# Altium schematic sheet 2_POWER.SchDoc
size A; SheetNumber: 2; SheetTotal: 3
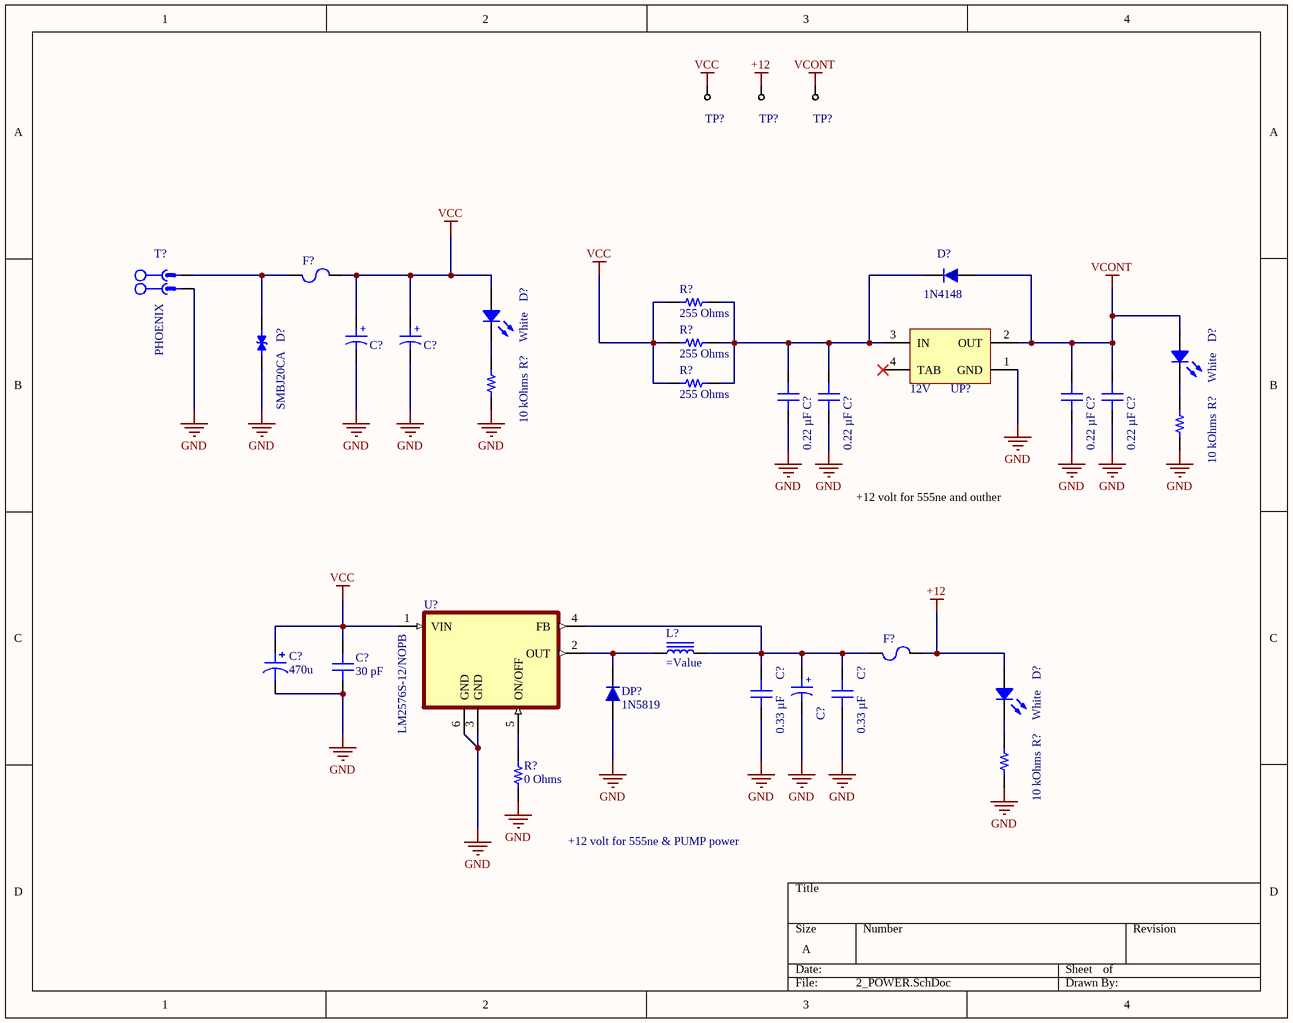
[diagram p0: 2_POWER.SchDoc]

## Parts
(Parts that share a designator on the sheet are numbered #1, #2 ... from top to bottom, then left to right.)
C?#1  Cap 10x21  [Cap electrolitic radial 10x20-5]  (value not drawn)
C?#2  Cap 10x21  [Cap electrolitic radial 10x20-5]  (value not drawn)
C?#3  0.22 µF  [CAP 1206_3216 - 0.8MM]
C?#4  0.22 µF  [CAP 1206_3216 - 0.8MM]
C?#5  0.22 µF  [CAP 1206_3216 - 0.8MM]
C?#6  0.22 µF  [CAP 1206_3216 - 0.8MM]
C?#7  470u  [CAP TH ALUM ELEC D10.00mm S5.00mm H17.50mm]
C?#8  30 pF  [CAP 0603_1608]
C?#9  Cap 10x21  [Cap electrolitic radial 10x20-5]  (value not drawn)
C?#10  0.33 µF  [CAP 0603_1608]
C?#11  0.33 µF  [CAP 0603_1608]
D?#1  1N4148  [Diode 1n4148 SMD]
D?#2  White  [LED 0603_1608]
D?#3  SMBJ20CA  [SMBJ20CA]
D?#4  White  [LED 0603_1608]
D?#5  White  [LED 0603_1608]
DP?  1N5819  [1N5819]
F?#1  3413.0214.22  [FUSE 1206_3216 0.6MM]  (value not drawn)
F?#2  3413.0214.22  [FUSE 1206_3216 0.6MM]  (value not drawn)
L?  (no value)  [BOURNS SRR1280]
R?#1  255 Ohms  [RES 1206_3216]
R?#2  255 Ohms  [RES 1206_3216]
R?#3  10 kOhms  [RES 0603_1608]
R?#4  255 Ohms  [RES 1206_3216]
R?#5  10 kOhms  [RES 0603_1608]
R?#6  10 kOhms  [RES 0603_1608]
R?#7  0 Ohms  [RES 0603_1608]
T?  PHOENIX  [ptr]
TP?#1  Test Point  [Test Point]  (value not drawn)
TP?#2  Test Point  [Test Point]  (value not drawn)
TP?#3  Test Point  [Test Point]  (value not drawn)
U?  LM2576S-12/NOPB  [LM2576S-12/NOPB]
UP?  12V  [SOT223]

## Nets
+12: D?#5.1 F?#2.2 TP?#2.1(T)
GND: C?#1.2 C?#2.2 C?#3.1 C?#4.1 C?#5.1 C?#6.1 C?#7.2 C?#8.1 C?#9.2 C?#10.1 C?#11.1 D?#3.1 DP?.1 R?#3.1 R?#5.1 R?#6.1 R?#7.1 T?.1 U?.3(GND) U?.6(GND) UP?.1(GND)
VCC: C?#1.1 C?#2.1 C?#7.1 C?#8.2 D?#2.1 F?#1.2 R?#1.1 R?#2.1 R?#4.1 TP?#1.1(T) U?.1(VIN)
VCONT: C?#5.2 C?#6.2 D?#1.1 D?#4.1 TP?#3.1(T) UP?.2(OUT)
NetC?#3_2: C?#3.2 C?#4.2 D?#1.2 R?#1.2 R?#2.2 R?#4.2 UP?.3(IN)
NetC?#9_1: C?#9.1 C?#10.2 C?#11.2 F?#2.1 L?.2 U?.4(FB)
NetD?#2_2: D?#2.2 R?#3.2
NetD?#3_2: D?#3.2 F?#1.1 T?.2
NetD?#4_2: D?#4.2 R?#5.2
NetD?#5_2: D?#5.2 R?#6.2
NetDP?_2: DP?.2 L?.1 U?.2(OUT)
NetR?#7_2: R?#7.2 U?.5(ON/OFF)

Not connected (* = marked no-connect by the designer): UP? 4(TAB)*

## Notes on the sheet
- +12 volt for 555ne and outher controler
- +12 volt for 555ne & PUMP power
- (in symbol Cap electrolitic radial 10x21) +

## Library data of the parts
C?#1 C?#2 C?#9 = Cap electrolitic radial 10x21: Cap electrolitic radial; Part. No: 100U/50V; Designer: Abbas Basereh; Data: 16-12-2016
C?#3-C?#6 = 885012208089: CAP CER 0.22UF 50V X7R 1206; manufacturer: Würth Elektronik; Tolerance: ±10%; Part Number: 885012208089; Value: 0.22 µF; Applications: General Purpose; Capacitance: 0.22 µF; componentlink1description: Datasheet; componentlink1url: https://katalog.we-online.de/pbs/datasheet/885012208089.pdf; componentlink2description: DigiKey Link; componentlink2url: https://www.digikey.com/en/products/detail/würth-elektronik/885012208089/5453557; Device Package: 1206 (3216 Metric); lastupdated: 1/30/2023 8:13:35 PM; Lifecycle Status: Active; Minimum Order: 1; Mounting Type: Surface Mount, MLCC; Operating Temperature: -55°C ~ 125°C; Package / Case: 1206 (3216 Metric); packaging: TapeAndReel; partid: 19236; Part Status: Active; price: 0.10; series: WCAP-CSGP; Size / Dimension: 0.126" L x 0.063" W (3.20mm x 1.60mm); Supplier 1: DigiKey; Supplier Part Number 1: 732-7702-1-ND; Temperature Coefficient: X7R; Thickness (Max): 0.041" (1.05mm); Voltage - Rated: 50V
C?#7 = UBX1C221MPL1TD: CAP ALUM 220UF 20% 16V RADIAL; manufacturer: Nichicon; Capacitance: 220µF; Lifetime @ Temp.: 1000 Hrs @ 150°C; Polarization: Polar; Ripple Current @ High Frequency: 300mA @ 100kHz; Ripple Current @ Low Frequency: 150mA @ 120Hz; value: 220µF; Part Number: UBX1C221MPL1TD; Applications: Automotive; componentlink1description: Datasheet; componentlink1url: http://nichicon-us.com/english/products/pdfs/e-ubx.pdf; componentlink2description: DigiKey Link; componentlink2url: http://digikey.com/product-detail/en/nichicon/UBX1C221MPL1TD/493-13194-1-ND/4333204; Device Package: Radial, Can; Height - Seated (Max): 0.689" (17.50mm); lastupdated: 9/2/2020 1:31:25 AM; Lead Spacing: 0.197" (5.00mm); Lifecycle Status: Active; Minimum Order: 1; Mounting Type: Through Hole; Operating Temperature: -55°C ~ 150°C; Package / Case: Radial, Can; packaging: TapeAndBox; partid: 12068; Part Status: Active; price: 0.49; series: UBX; Size / Dimension: 0.394" Dia (10.00mm); Supplier 1: DigiKey; Supplier Part Number 1: 493-13194-1-ND; Tolerance: ±20%; Voltage - Rated: 16V
C?#8 = 600S300FT250XT: CAP CER 30PF 250V C0G/NP0 0603; manufacturer: American Technical Ceramics; Temperature Coefficient: C0G, NP0; Tolerance: ±1%; Part Number: 600S300FT250XT; Value: 30 pF; Applications: RF, Microwave, High Frequency, Bypass, Decoupling; Capacitance: 30 pF; componentlink1description: Datasheet; componentlink1url: http://www.atceramics.com/UserFiles/600s.pdf; componentlink2description: DigiKey Link; componentlink2url: https://www.digikey.com/en/products/detail/american-technical-ceramics/600S300FT250XT/3905218; Device Package: 0603 (1608 Metric); Features: High Q, Low Loss, Ultra Low ESR; lastupdated: 1/30/2023 8:08:28 PM; Lifecycle Status: Active; Minimum Order: 1; Mounting Type: Surface Mount, MLCC; Operating Temperature: -55°C ~ 125°C; Package / Case: 0603 (1608 Metric); packaging: TapeAndReel; partid: 2159; Part Status: Active; price: 0.49; series: ATC 600S; Size / Dimension: 0.063" L x 0.032" W (1.60mm x 0.81mm); Supplier 1: DigiKey; Supplier Part Number 1: 1284-1205-1-ND; Thickness (Max): 0.035" (0.89mm); Voltage - Rated: 250V
C?#10 C?#11 = CC0603KRX7R6BB334: CAP CER 0.33UF 10V X7R 0603; manufacturer: Yageo; Tolerance: ±10%; Part Number: CC0603KRX7R6BB334; Value: 0.33 µF; Applications: General Purpose; Capacitance: 0.33 µF; componentlink1description: Datasheet; componentlink1url: https://www.yageo.com/upload/media/product/productsearch/datasheet/mlcc/UPY-GPHC_X7R_6.3V-to-50V_18.pdf; componentlink2description: DigiKey Link; componentlink2url: https://www.digikey.com/en/products/detail/yageo/CC0603KRX7R6BB334/5883747; Device Package: 0603 (1608 Metric); lastupdated: 1/30/2023 8:08:28 PM; Lifecycle Status: Active; Minimum Order: 1; Mounting Type: Surface Mount, MLCC; Operating Temperature: -55°C ~ 125°C; Package / Case: 0603 (1608 Metric); packaging: TapeAndReel; partid: 2209; Part Status: Active; price: 0.01; series: CC; Size / Dimension: 0.063" L x 0.031" W (1.60mm x 0.80mm); Supplier 1: DigiKey; Supplier Part Number 1: 311-3368-1-ND; Temperature Coefficient: X7R; Thickness (Max): 0.035" (0.90mm); Voltage - Rated: 10V
D?#1 = 1N4148 SMD: General Semicoductor
D?#2 D?#4 D?#5 = CL-194S-WS-SD-T: LED WHITE SMD; Manufacturer: Citizen; Configuration: Standard; Current - Test: 5mA; Lens Color: 0.30mm; Lens Size: 1.10mm x 0.80mm; Lens Style: Rectangle with Flat Top; Millicandela Rating: 260mcd; Voltage - Forward (Vf) (Typ): 2.9V; Part Number: CL-194S-WS-SD-T; Color: White; ComponentLink1Description: Datasheet; ComponentLink1URL: http://ce.citizen.co.jp/up_img/product/WBtpQ6f1JXom/CL-194S.pdf; ComponentLink2Description: DigiKey Link; ComponentLink2URL: https://www.digikey.com/en/products/detail/citizen/CL-194S-WS-SD-T/6005902; Device Package: 0603 (1608 Metric); Height (Max): 0.30mm; LastUpdated: 1/30/2023 8:53:40 PM; Lifecycle Status: Active; Minimum Order: 1; Mounting Type: Surface Mount; Package / Case: 0603 (1608 Metric); Packaging: TapeAndReel; PartId: 905; Part Status: Active; Price: 0.07; Series: CL-194S; Size / Dimension: 1.60mm L x 0.80mm W; Supplier 1: DigiKey; Supplier Part Number 1: 1642-1490-1-ND; Value: White
D?#3 = SMBJ20CA: 600W, 23.4V, 5%, Bidirectional, TVS; MF: Taiwan Semiconductor; MP: SMBJ20CA; SnapEDA_Link: https://www.snapeda.com/parts/SMBJ20CA/Taiwan+Semiconductor/view-part/?ref=snap; Value: *; Package: SMB Taiwan Semiconductor; Price: None; Availability: In Stock; Purchase-URL: https://pricing.snapeda.com/search/part/SMBJ20CA/?ref=eda; Check_prices: https://www.snapeda.com/parts/SMBJ20CA/Taiwan+Semiconductor/view-part/?ref=eda
DP? = 1N5819: Schottkey Rectifiers; Designer: Abbas Basereh; Data: 16-12-2016; Link: *; Part. No: *
F?#1 F?#2 = 3413.0214.22: FUSE BOARD MNT 630MA 32VAC 63VDC; Manufacturer: Schurter Inc.; Approval Agency: cURus, VDE; Breaking Capacity @ Rated Voltage: 63A; Fuse Type: Board Mount (Cartridge Style Excluded); Melting I²t: 0.076; Response Time: Fast Blow; Voltage Rating - AC: 32V; Voltage Rating - DC: 63V; Part Number: 3413.0214.22; Approvals: cURus, VDE; ComponentLink1Description: Datasheet; ComponentLink1URL: https://us.schurter.com/pdf/english/typ_USI_1206.pdf; ComponentLink2Description: DigiKey Link; ComponentLink2URL: http://digikey.com/product-detail/en/schurter-inc/3413.0214.22/486-1142-1-ND/1522974; Current Rating (Amps): 630mA; Device Package: 1206 (3216 Metric); LastUpdated: 9/2/2020 1:30:41 AM; Lifecycle Status: Active; Minimum Order: 1; Mounting Type: Surface Mount; Operating Temperature: -55°C ~ 90°C; Package / Case: 1206 (3216 Metric); Packaging: TapeAndReel; Part Status: Active; Price: 0.26; Series: USI 1206; Size / Dimension: 0.126" L x 0.063" W x 0.024" H (3.20mm x 1.60mm x 0.60mm); Supplier 1: DigiKey; Supplier Part Number 1: 486-1142-1-ND
L? = SRR1280-680M: FIXED IND 68UH 2.4A 120 MOHM SMD; Part Number: SRR1280-680M
R?#1 R?#2 R?#4 = RK73H2BTTD2550F: RES 255 OHM 1% 1/4W 1206; Manufacturer: KOA Speer Electronics, Inc.; Power (Watts): 0.25W, 1/4W; Temperature Coefficient: ±100ppm/°C; Part Number: RK73H2BTTD2550F; ComponentLink1Description: Datasheet; ComponentLink1URL: http://www.koaspeer.com/catimages/Products/RK73H/RK73H.pdf; ComponentLink2Description: DigiKey Link; ComponentLink2URL: https://www.digikey.com/en/products/detail/koa-speer-electronics-inc/RK73H2BTTD2550F/10235945; Composition: Thick Film; Device Package: 1206 (3216 Metric); Features: Automotive AEC-Q200, Moisture Resistant; Height - Seated (Max): 0.028" (0.70mm); LastUpdated: 1/30/2023 8:32:45 PM; Lifecycle Status: Active; Minimum Order: 1; Number of Terminations: 2; Operating Temperature: -55°C ~ 155°C; Package / Case: 1206 (3216 Metric); Packaging: TapeAndReel; PartId: 27211; Part Status: Active; Price: 0.01; Ratings: AEC-Q200; Resistance: 255 Ohms; Series: RK73H; Size / Dimension: 0.126" L x 0.063" W (3.20mm x 1.60mm); Supplier 1: DigiKey; Supplier Part Number 1: 2019-RK73H2BTTD2550FCT-ND; Supplier Device Package: 1206; Tolerance: ±1%; Value: 255 Ohms
R?#3 R?#5 R?#6 = CPF0603B10KE: RES SMD 10K OHM 0.1% 1/16W 0603; Manufacturer: TE Connectivity Passive Product; Power (Watts): 0.063W, 1/16W; Temperature Coefficient: ±25ppm/°C; Part Number: CPF0603B10KE; Value: 10 kOhms; ComponentLink1Description: Datasheet; ComponentLink1URL: https://www.te.com/commerce/DocumentDelivery/DDEController?Action=srchrtrv&DocNm=1773200&DocType=DS&DocLang=English; ComponentLink2Description: DigiKey Link; ComponentLink2URL: https://www.digikey.com/en/products/detail/te-connectivity-passive-product/CPF0603B10KE/2389826; Composition: Thin Film; Device Package: 0603 (1608 Metric); Height - Seated (Max): 0.022" (0.55mm); LastUpdated: 1/24/2023 9:54:36 PM; Lifecycle Status: Active; Minimum Order: 1; Number of Terminations: 2; Operating Temperature: -55°C ~ 155°C; Package / Case: 0603 (1608 Metric); Packaging: TapeAndReel; PartId: 4872; Part Status: Active; Price: 0.09; Resistance: 10 kOhms; Series: CPF, Neohm; Size / Dimension: 0.061" L x 0.031" W (1.55mm x 0.80mm); Supplier 1: DigiKey; Supplier Part Number 1: A119886CT-ND; Supplier Device Package: 0603; Tolerance: ±0.1%
R?#7 = PA0603-R-070RL: RES 0 OHM JUMPER 1/10W 0603; Manufacturer: Yageo; Power (Watts): 0.1W, 1/10W; Temperature Coefficient: ±150ppm/°C; Part Number: PA0603-R-070RL; Value: 0 Ohms; ComponentLink1Description: Datasheet; ComponentLink1URL: http://www.yageo.com/NewPortal/_en/search/productDocs.jsp?YageoPartNumber=PA0603-R-070RL; ComponentLink2Description: DigiKey Link; ComponentLink2URL: https://www.digikey.com/en/products/detail/yageo/PA0603-R-070RL/8255972; Composition: Metal Element; Device Package: 0603 (1608 Metric); Features: Automotive AEC-Q200, Current Sense; Height - Seated (Max): 0.024" (0.60mm); LastUpdated: 1/24/2023 9:54:36 PM; Lifecycle Status: Active; Minimum Order: 1; Number of Terminations: 2; Operating Temperature: -55°C ~ 155°C; Package / Case: 0603 (1608 Metric); Packaging: TapeAndReel; PartId: 4862; Part Status: Active; Price: 0.08; Resistance: 0 Ohms; Series: PA; Size / Dimension: 0.063" L x 0.031" W (1.60mm x 0.80mm); Supplier 1: DigiKey; Supplier Part Number 1: YAG5757CT-ND; Supplier Device Package: 0603; Tolerance: Jumper
T? = ptr: 2 Pitch: 5.08 mm Color: green Contact surface: Tin Assembly; Manufacturer: PHOENIX CONTACT; Connector type: PCB Terminal Block; designer: ABBAS BASEREH; Max Current: 12 A; Positions: 2; Voltage: 320 V; Category: Connector; ComponentLink1Description: Header, Nominal current: 12 A Rated voltage (III/2): 320 V Number of positions: 2 Pitch: 5.08 mm Color: green Contact surface: Tin Assembly: Soldering  DESIGNER:ABBAS BASEREH; ComponentLink2Description: Reference; Mounting Technology: Through-Hole; Pin Count: 2; Revision 1: 2017-3-1; Status: Unreleased; PART.NO: PHOENIX
UP? = AMS1117-x.x: x.x Volt, 800mA Low-Dropout Linear Regulator, 4-pin SOT-223; Designer: Ali Hafizi; Data: 16-12-2016
U? = LM2576S-12/NOPB: Package: None; Price: None; Availability: Unavailable; MP: LM2576S-12; Value: *